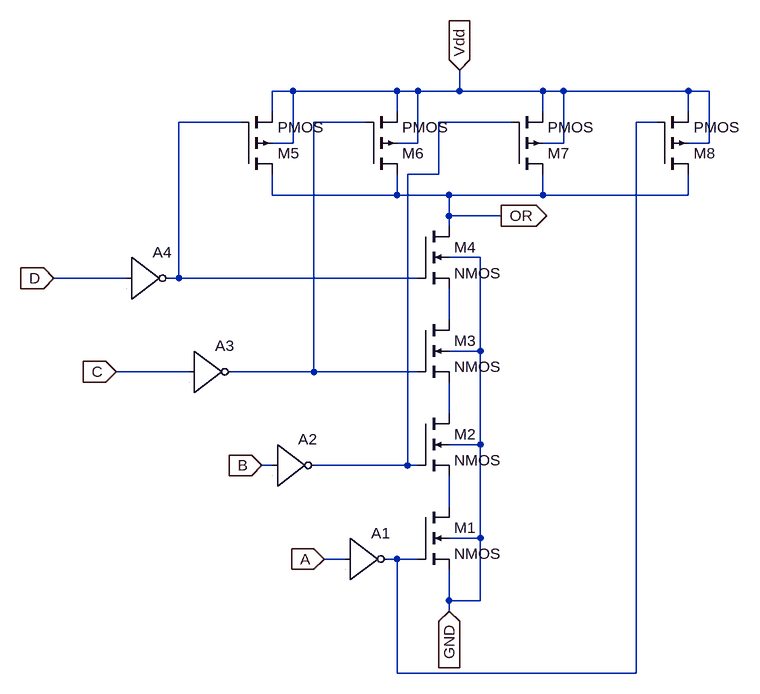
[diagram p0: schematic OR_4IP.asc]
OR_4IP.asc, the LTspice schematic file:
Version 4
SHEET 1 896 680
WIRE 208 -432 176 -432
WIRE 368 -432 208 -432
WIRE 400 -432 368 -432
WIRE 464 -432 464 -464
WIRE 464 -432 400 -432
WIRE 592 -432 464 -432
WIRE 624 -432 592 -432
WIRE 816 -432 624 -432
WIRE 848 -432 816 -432
WIRE 176 -400 176 -432
WIRE 368 -400 368 -432
WIRE 592 -400 592 -432
WIRE 816 -400 816 -432
WIRE 128 -384 32 -384
WIRE 320 -384 240 -384
WIRE 544 -384 432 -384
WIRE 768 -384 736 -384
WIRE 208 -352 208 -432
WIRE 208 -352 176 -352
WIRE 400 -352 400 -432
WIRE 400 -352 368 -352
WIRE 624 -352 624 -432
WIRE 624 -352 592 -352
WIRE 848 -352 848 -432
WIRE 848 -352 816 -352
WIRE 432 -304 432 -384
WIRE 432 -304 384 -304
WIRE 176 -272 176 -304
WIRE 368 -272 368 -304
WIRE 368 -272 176 -272
WIRE 448 -272 368 -272
WIRE 592 -272 592 -304
WIRE 592 -272 448 -272
WIRE 816 -272 816 -304
WIRE 816 -272 592 -272
WIRE 448 -240 448 -272
WIRE 528 -240 448 -240
WIRE 448 -224 448 -240
WIRE 496 -176 448 -176
WIRE -48 -144 -160 -144
WIRE 32 -144 32 -384
WIRE 32 -144 16 -144
WIRE 400 -144 32 -144
WIRE 448 -80 448 -128
WIRE 496 -32 496 -176
WIRE 496 -32 448 -32
WIRE 48 0 -64 0
WIRE 240 0 240 -384
WIRE 240 0 112 0
WIRE 400 0 240 0
WIRE 448 64 448 16
WIRE 496 112 496 -32
WIRE 496 112 448 112
WIRE 176 144 160 144
WIRE 384 144 384 -304
WIRE 384 144 240 144
WIRE 400 144 384 144
WIRE 448 208 448 160
WIRE 496 256 496 112
WIRE 496 256 448 256
WIRE 288 288 256 288
WIRE 368 288 352 288
WIRE 400 288 368 288
WIRE 448 352 448 304
WIRE 496 352 496 256
WIRE 496 352 448 352
WIRE 448 368 448 352
WIRE 368 464 368 288
WIRE 736 464 736 -384
WIRE 736 464 368 464
FLAG -64 0 C
IOPIN -64 0 In
FLAG -160 -144 D
IOPIN -160 -144 In
FLAG 464 -464 Vdd
IOPIN 464 -464 In
FLAG 160 144 B
IOPIN 160 144 In
FLAG 256 288 A
IOPIN 256 288 In
FLAG 528 -240 OR
IOPIN 528 -240 Out
FLAG 448 368 GND
IOPIN 448 368 In
SYMBOL nmos4 400 208 R0
SYMATTR InstName M1
SYMBOL nmos4 400 64 R0
SYMATTR InstName M2
SYMBOL nmos4 400 -80 R0
SYMATTR InstName M3
SYMBOL nmos4 400 -224 R0
SYMATTR InstName M4
SYMBOL Digital\\inv 288 224 R0
SYMATTR InstName A1
SYMBOL Digital\\inv 176 80 R0
SYMATTR InstName A2
SYMBOL Digital\\inv 48 -64 R0
SYMATTR InstName A3
SYMBOL Digital\\inv -48 -208 R0
SYMATTR InstName A4
SYMBOL pmos4 128 -304 M180
SYMATTR InstName M5
SYMBOL pmos4 320 -304 M180
SYMATTR InstName M6
SYMBOL pmos4 544 -304 M180
SYMATTR InstName M7
SYMBOL pmos4 768 -304 M180
SYMATTR InstName M8

The netlist it stands for:
* OR_4IP.asc
M1 N007 N004 GND GND NMOS
M2 N006 N003 N007 GND NMOS
M3 N005 N002 N006 GND NMOS
M4 OR N001 N005 GND NMOS
A1 A 0 0 0 0 N004 0 0 BUF
A2 B 0 0 0 0 N003 0 0 BUF
A3 C 0 0 0 0 N002 0 0 BUF
A4 D 0 0 0 0 N001 0 0 BUF
M5 OR N001 Vdd Vdd PMOS
M6 OR N002 Vdd Vdd PMOS
M7 OR N003 Vdd Vdd PMOS
M8 OR N004 Vdd Vdd PMOS
.model NMOS NMOS
.model PMOS PMOS
.lib standard.mos
.backanno
.end